# EasyEDA schematic 5.json
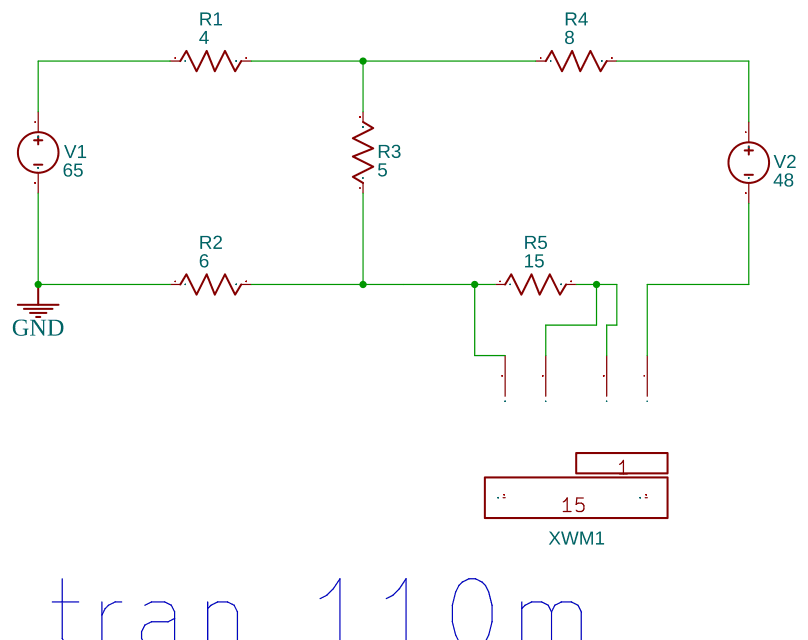
[diagram p0: schematic sheet]

## Parts
R1  4  [AXIAL-0.3]
R2  6  [AXIAL-0.3]
R3  5  [AXIAL-0.3]
R4  8  [AXIAL-0.3]
R5  15  [AXIAL-0.3]
V1  65  [HDR1X2]
V2  48  [HDR1X2]
XWM1  Wattmeter

## Library data of the parts
R1-R5 = Resistor_US: Resistance: 1k; Contributor: EasyEDA; Supplier: YUJING
V1 V2 = VDC: Contributor: EasyEDA; sim: true
XWM1 = WATTMETER: Contributor: EasyEDA; NameDisplay: 0; sim: true

## Nets
GND: R2.1 V1.2
Net-(R1-1): R1.1 V1.1
Net-(R1-2): R1.2 R3.2 R4.1
Net-(R2-2): R2.2 R3.1 R5.1 XWM1.1(V+)
Net-(R4-2): R4.2 V2.1
Net-(R5-2): R5.2 XWM1.2(V-) XWM1.3(I+)
Net-(V2-2): V2.2 XWM1.4(I-)

Not connected (* = marked no-connect by the designer): XWM1 P PF

## Notes on the sheet
- .tran 110m
